# Altium project STM32F103RCT6_DEVELOPMENT_BOARD.PrjPcb
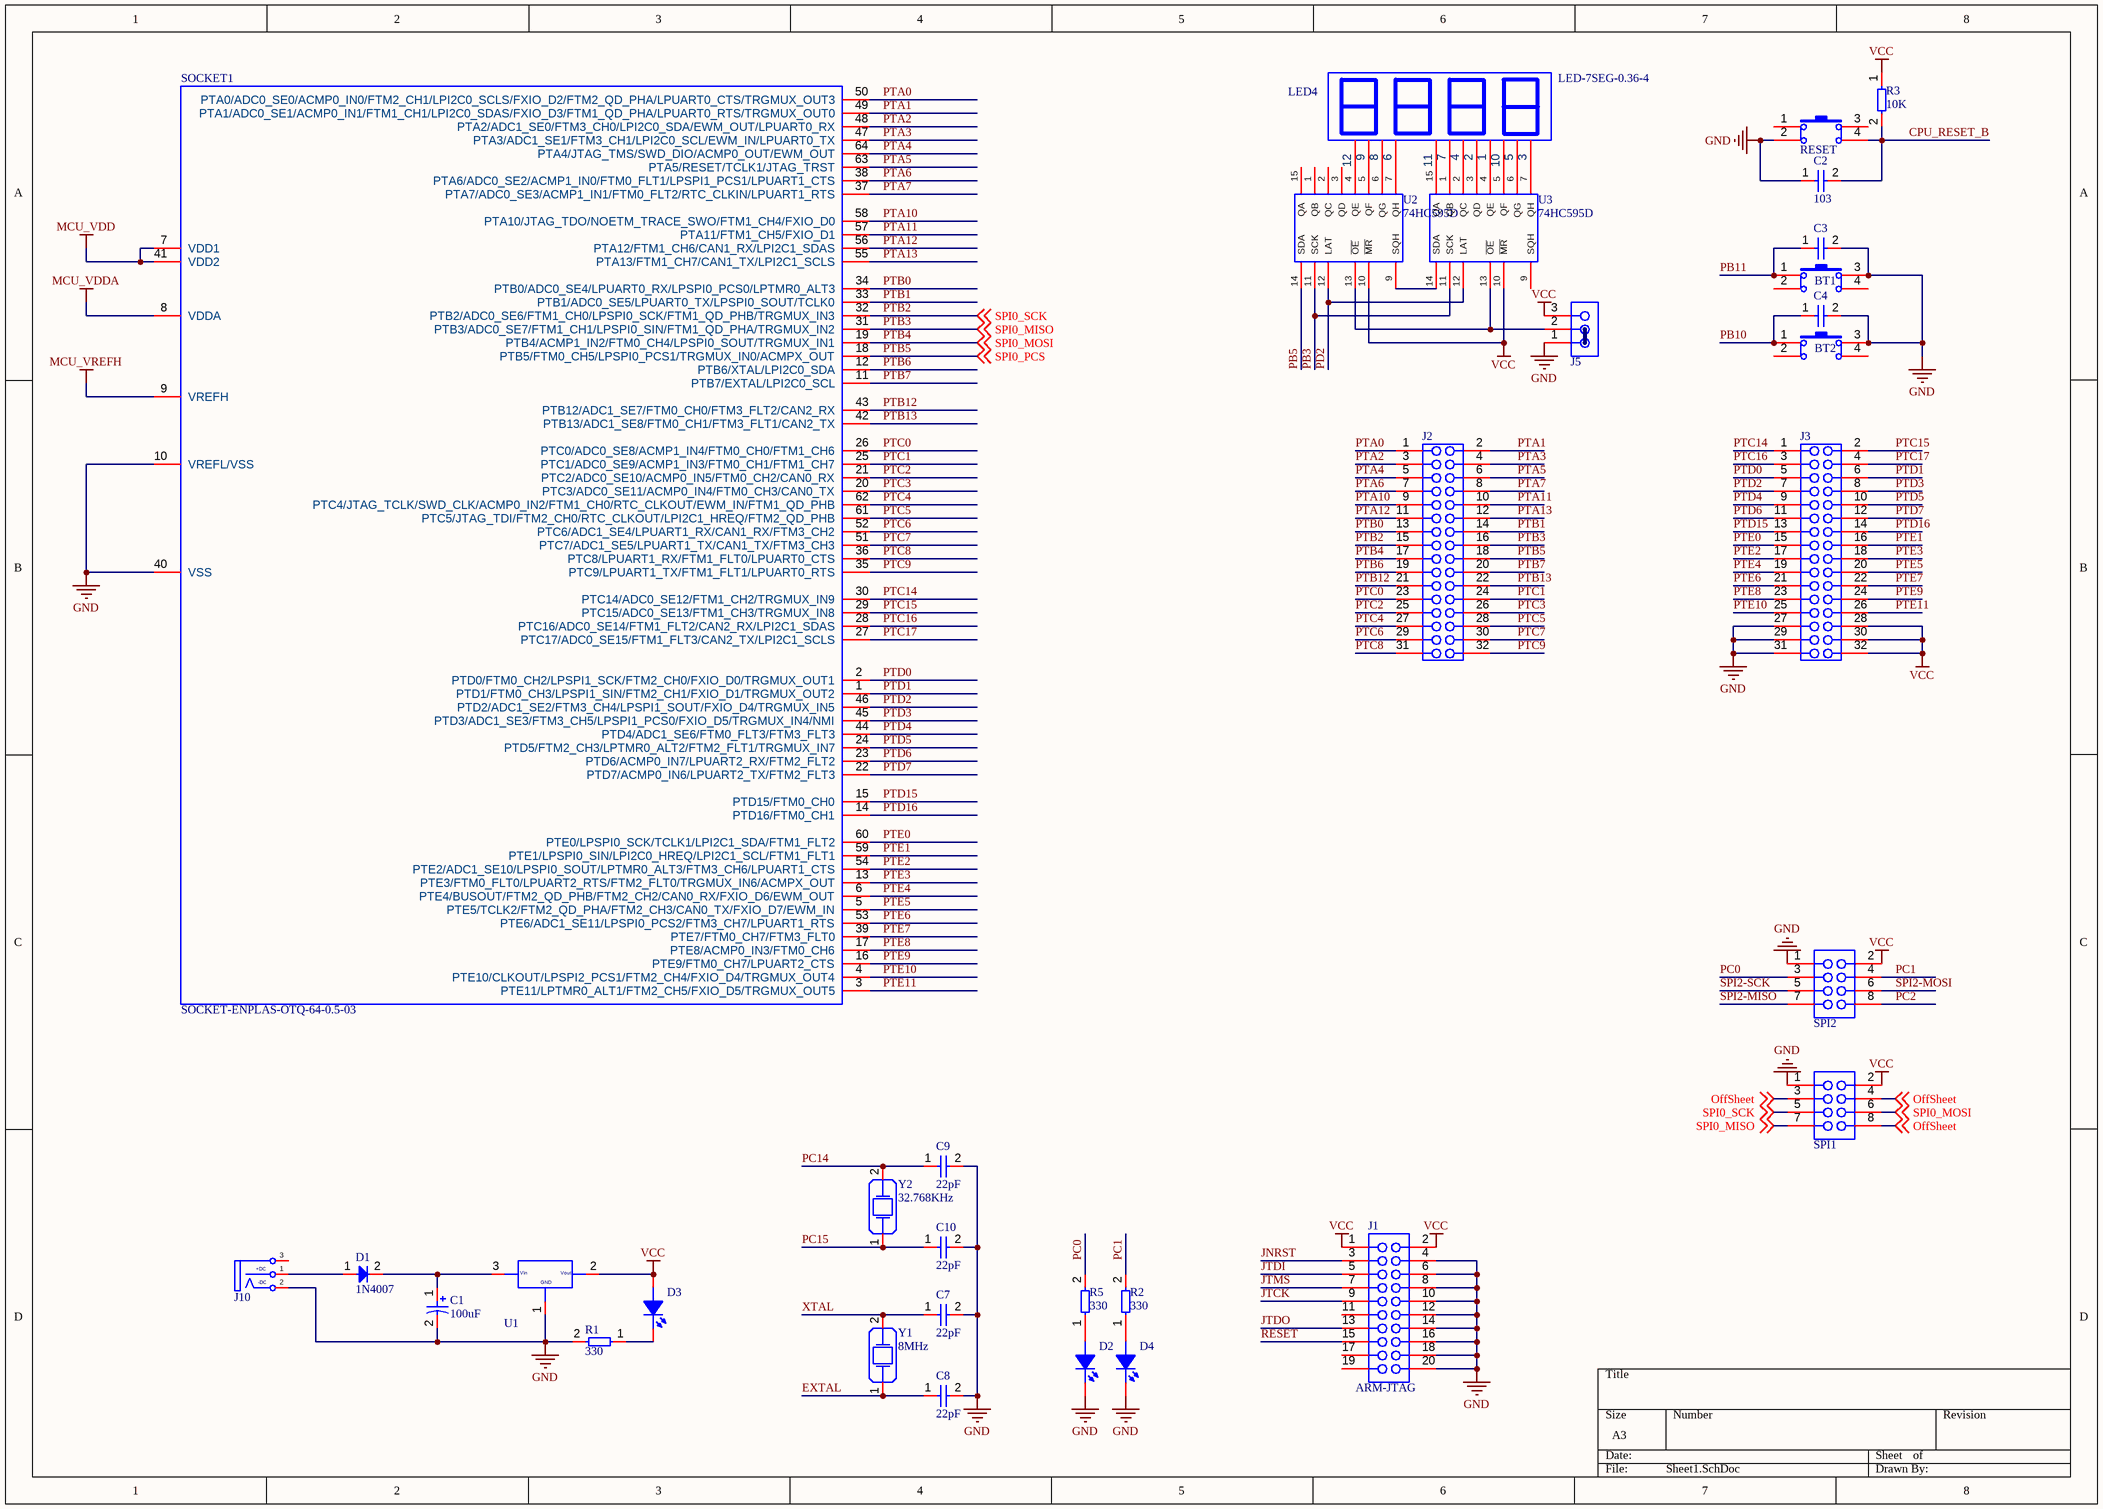
[diagram p0: Sheet1.SchDoc]
1 sheet, 33 parts. Net scope: global (net labels, ports and power ports of the same name join across sheets).
Board file: PCB1.PcbDoc

## Sheet Sheet1.SchDoc
size A3

### Parts
BT1  Button Hole  [BUTTON_HOLE_5.0mm]  (value not drawn)
BT2  Button Hole  [BUTTON_HOLE_5.0mm]  (value not drawn)
C1  100uF  [CAP_RAD_7mm]
C2  103  [C0805]
C3  103  [C0805]  (value not drawn)
C4  103  [C0805]  (value not drawn)
C7  22pF  [C0805]
C8  22pF  [C0805]
C9  22pF  [C0805]
C10  22pF  [C0805]
D1  1N4007  [DO-41]
D2  LED0805  [L0805RED]  (value not drawn)
D3  LED0805  [L0805RED]  (value not drawn)
D4  LED0805  [L0805RED]  (value not drawn)
J1  ARM-JTAG  [IDC_CONNECTOR_20_2.54]
J2  Header 16x2 TH Pitch 2.54mm  [Header 16x2 TH Pitch 2.54mm]  (value not drawn)
J3  Header 16x2 TH Pitch 2.54mm  [Header 16x2 TH Pitch 2.54mm]  (value not drawn)
J5  7SEG-OE  [Header 3x1 TH Pitch 2.54mm]  (value not drawn)
J10  Connector  [DC_K375A_Power]  (value not drawn)
LED4  LED-7SEG-0.36-4  [LED-7SEG-0.36-4]
R1  330  [RES-0.25W-H-MF]
R2  330  [R0805]
R3  10K  [RES-0.25W-H-MF]
R5  330  [R0805]
RESET  Button Hole  [BUTTON_HOLE_5.0mm]  (value not drawn)
SOCKET1  SOCKET-ENPLAS-OTQ-64-0.5-03  [SOCKET-ADAPTER-OTQ-64-05-03]
SPI1  Header 4x2 TH Pitch 2.54mm  [Header 4x2 TH Pitch 2.54mm]  (value not drawn)
SPI2  Header 4x2 TH Pitch 2.54mm  [Header 4x2 TH Pitch 2.54mm]  (value not drawn)
U1  AMS1117  [SOT223-3]  (value not drawn)
U2  74HC595D  [SO16]
U3  74HC595D  [SO16]
Y1  8MHz  [SMD5032]
Y2  32.768KHz  [DT-26]

### Nets
GND: BT1.3 BT2.3 C1.2 C2.1 C3.2 C4.2 C7.2 C8.2 C9.2 C10.2 D2.2(K) D4.2(K) J1.4 J1.6 J1.8 J1.10 J1.12 J1.14 J1.16 J1.18 J1.20 J3.27 J3.29 J3.31 J5.1 J10.2(DC-) R1.2 RESET.2 SOCKET1.10(VREFL/VSS) SOCKET1.40(VSS) SPI1.1 SPI2.1 U1.1 U2.8 U3.8
MCU_VDD: SOCKET1.7(VDD1) SOCKET1.41(VDD2)
MCU_VDDA: SOCKET1.8(VDDA)
MCU_VREFH: SOCKET1.9(VREFH)
VCC: D3.1(A) J1.1 J1.2 J3.28 J3.30 J3.32 J5.3 R3.1 SPI1.2 SPI2.2 U1.2 U2.10(~{MR}) U2.16 U3.10(~{MR}) U3.16
CPU_RESET_B: C2.2 R3.2 RESET.4
EXTAL: C8.1 Y1.1
JNRST: J1.3
JTCK: J1.9
JTDI: J1.5
JTDO: J1.13
JTMS: J1.7
OffSheet: SPI1.3 SPI1.4 SPI1.8 ; off-sheet OffSheet
PB3: U2.11(SCK) U3.11(SCK)
PB5: U2.14(SDA)
PB10: BT2.1 C4.1
PB11: BT1.1 C3.1
PC0: R5.2 SPI2.3
PC1: R2.2 SPI2.4
PC2: SPI2.8
PC14: C9.1 Y2.2
PC15: C10.1 Y2.1
PD2: U2.12(LAT) U3.12(LAT)
PTA0: J2.1 SOCKET1.50(PTA0/ADC0_SE0/ACMP0_IN0/FTM2_CH1/LPI2C0_SCLS/FXIO_D2/FTM2_QD_PHA/LPUART0_CTS/TRGMUX_OUT3)
PTA1: J2.2 SOCKET1.49(PTA1/ADC0_SE1/ACMP0_IN1/FTM1_CH1/LPI2C0_SDAS/FXIO_D3/FTM1_QD_PHA/LPUART0_RTS/TRGMUX_OUT0)
PTA2: J2.3 SOCKET1.48(PTA2/ADC1_SE0/FTM3_CH0/LPI2C0_SDA/EWM_OUT/LPUART0_RX)
PTA3: J2.4 SOCKET1.47(PTA3/ADC1_SE1/FTM3_CH1/LPI2C0_SCL/EWM_IN/LPUART0_TX)
PTA4: J2.5 SOCKET1.64(PTA4/JTAG_TMS/SWD_DIO/ACMP0_OUT/EWM_OUT)
PTA5: J2.6 SOCKET1.63(PTA5/RESET/TCLK1/JTAG_TRST)
PTA6: J2.7 SOCKET1.38(PTA6/ADC0_SE2/ACMP1_IN0/FTM0_FLT1/LPSPI1_PCS1/LPUART1_CTS)
PTA7: J2.8 SOCKET1.37(PTA7/ADC0_SE3/ACMP1_IN1/FTM0_FLT2/RTC_CLKIN/LPUART1_RTS)
PTA10: J2.9 SOCKET1.58(PTA10/JTAG_TDO/NOETM_TRACE_SWO/FTM1_CH4/FXIO_D0)
PTA11: J2.10 SOCKET1.57(PTA11/FTM1_CH5/FXIO_D1)
PTA12: J2.11 SOCKET1.56(PTA12/FTM1_CH6/CAN1_RX/LPI2C1_SDAS)
PTA13: J2.12 SOCKET1.55(PTA13/FTM1_CH7/CAN1_TX/LPI2C1_SCLS)
PTB0: J2.13 SOCKET1.34(PTB0/ADC0_SE4/LPUART0_RX/LPSPI0_PCS0/LPTMR0_ALT3)
PTB1: J2.14 SOCKET1.33(PTB1/ADC0_SE5/LPUART0_TX/LPSPI0_SOUT/TCLK0)
PTB2: J2.15 SOCKET1.32(PTB2/ADC0_SE6/FTM1_CH0/LPSPI0_SCK/FTM1_QD_PHB/TRGMUX_IN3) SPI1.5 ; off-sheet SPI0_SCK  [also labelled SPI0_SCK]
PTB3: J2.16 SOCKET1.31(PTB3/ADC0_SE7/FTM1_CH1/LPSPI0_SIN/FTM1_QD_PHA/TRGMUX_IN2) SPI1.7 ; off-sheet SPI0_MISO  [also labelled SPI0_MISO]
PTB4: J2.17 SOCKET1.19(PTB4/ACMP1_IN2/FTM0_CH4/LPSPI0_SOUT/TRGMUX_IN1) SPI1.6 ; off-sheet SPI0_MOSI  [also labelled SPI0_MOSI]
PTB5: J2.18 SOCKET1.18(PTB5/FTM0_CH5/LPSPI0_PCS1/TRGMUX_IN0/ACMPX_OUT) ; off-sheet SPI0_PCS  [also labelled SPI0_PCS]
PTB6: J2.19 SOCKET1.12(PTB6/XTAL/LPI2C0_SDA)
PTB7: J2.20 SOCKET1.11(PTB7/EXTAL/LPI2C0_SCL)
PTB12: J2.21 SOCKET1.43(PTB12/ADC1_SE7/FTM0_CH0/FTM3_FLT2/CAN2_RX)
PTB13: J2.22 SOCKET1.42(PTB13/ADC1_SE8/FTM0_CH1/FTM3_FLT1/CAN2_TX)
PTC0: J2.23 SOCKET1.26(PTC0/ADC0_SE8/ACMP1_IN4/FTM0_CH0/FTM1_CH6)
PTC1: J2.24 SOCKET1.25(PTC1/ADC0_SE9/ACMP1_IN3/FTM0_CH1/FTM1_CH7)
PTC2: J2.25 SOCKET1.21(PTC2/ADC0_SE10/ACMP0_IN5/FTM0_CH2/CAN0_RX)
PTC3: J2.26 SOCKET1.20(PTC3/ADC0_SE11/ACMP0_IN4/FTM0_CH3/CAN0_TX)
PTC4: J2.27 SOCKET1.62(PTC4/JTAG_TCLK/SWD_CLK/ACMP0_IN2/FTM1_CH0/RTC_CLKOUT/EWM_IN/FTM1_QD_PHB)
PTC5: J2.28 SOCKET1.61(PTC5/JTAG_TDI/FTM2_CH0/RTC_CLKOUT/LPI2C1_HREQ/FTM2_QD_PHB)
PTC6: J2.29 SOCKET1.52(PTC6/ADC1_SE4/LPUART1_RX/CAN1_RX/FTM3_CH2)
PTC7: J2.30 SOCKET1.51(PTC7/ADC1_SE5/LPUART1_TX/CAN1_TX/FTM3_CH3)
PTC8: J2.31 SOCKET1.36(PTC8/LPUART1_RX/FTM1_FLT0/LPUART0_CTS)
PTC9: J2.32 SOCKET1.35(PTC9/LPUART1_TX/FTM1_FLT1/LPUART0_RTS)
PTC14: J3.1 SOCKET1.30(PTC14/ADC0_SE12/FTM1_CH2/TRGMUX_IN9)
PTC15: J3.2 SOCKET1.29(PTC15/ADC0_SE13/FTM1_CH3/TRGMUX_IN8)
PTC16: J3.3 SOCKET1.28(PTC16/ADC0_SE14/FTM1_FLT2/CAN2_RX/LPI2C1_SDAS)
PTC17: J3.4 SOCKET1.27(PTC17/ADC0_SE15/FTM1_FLT3/CAN2_TX/LPI2C1_SCLS)
PTD0: J3.5 SOCKET1.2(PTD0/FTM0_CH2/LPSPI1_SCK/FTM2_CH0/FXIO_D0/TRGMUX_OUT1)
PTD1: J3.6 SOCKET1.1(PTD1/FTM0_CH3/LPSPI1_SIN/FTM2_CH1/FXIO_D1/TRGMUX_OUT2)
PTD2: J3.7 SOCKET1.46(PTD2/ADC1_SE2/FTM3_CH4/LPSPI1_SOUT/FXIO_D4/TRGMUX_IN5)
PTD3: J3.8 SOCKET1.45(PTD3/ADC1_SE3/FTM3_CH5/LPSPI1_PCS0/FXIO_D5/TRGMUX_IN4/NMI)
PTD4: J3.9 SOCKET1.44(PTD4/ADC1_SE6/FTM0_FLT3/FTM3_FLT3)
PTD5: J3.10 SOCKET1.24(PTD5/FTM2_CH3/LPTMR0_ALT2/FTM2_FLT1/TRGMUX_IN7)
PTD6: J3.11 SOCKET1.23(PTD6/ACMP0_IN7/LPUART2_RX/FTM2_FLT2)
PTD7: J3.12 SOCKET1.22(PTD7/ACMP0_IN6/LPUART2_TX/FTM2_FLT3)
PTD15: J3.13 SOCKET1.15(PTD15/FTM0_CH0)
PTD16: J3.14 SOCKET1.14(PTD16/FTM0_CH1)
PTE0: J3.15 SOCKET1.60(PTE0/LPSPI0_SCK/TCLK1/LPI2C1_SDA/FTM1_FLT2)
PTE1: J3.16 SOCKET1.59(PTE1/LPSPI0_SIN/LPI2C0_HREQ/LPI2C1_SCL/FTM1_FLT1)
PTE2: J3.17 SOCKET1.54(PTE2/ADC1_SE10/LPSPI0_SOUT/LPTMR0_ALT3/FTM3_CH6/LPUART1_CTS)
PTE3: J3.18 SOCKET1.13(PTE3/FTM0_FLT0/LPUART2_RTS/FTM2_FLT0/TRGMUX_IN6/ACMPX_OUT)
PTE4: J3.19 SOCKET1.6(PTE4/BUSOUT/FTM2_QD_PHB/FTM2_CH2/CAN0_RX/FXIO_D6/EWM_OUT)
PTE5: J3.20 SOCKET1.5(PTE5/TCLK2/FTM2_QD_PHA/FTM2_CH3/CAN0_TX/FXIO_D7/EWM_IN)
PTE6: J3.21 SOCKET1.53(PTE6/ADC1_SE11/LPSPI0_PCS2/FTM3_CH7/LPUART1_RTS)
PTE7: J3.22 SOCKET1.39(PTE7/FTM0_CH7/FTM3_FLT0)
PTE8: J3.23 SOCKET1.17(PTE8/ACMP0_IN3/FTM0_CH6)
PTE9: J3.24 SOCKET1.16(PTE9/FTM0_CH7/LPUART2_CTS)
PTE10: J3.25 SOCKET1.4(PTE10/CLKOUT/LPSPI2_PCS1/FTM2_CH4/FXIO_D4/TRGMUX_OUT4)
PTE11: J3.26 SOCKET1.3(PTE11/LPTMR0_ALT1/FTM2_CH5/FXIO_D5/TRGMUX_OUT5)
RESET: J1.15
SPI2-MISO: SPI2.7
SPI2-MOSI: SPI2.6
SPI2-SCK: SPI2.5
XTAL: C7.1 Y1.2
NetC1_1: C1.1 D1.2 U1.3
NetD1_1: D1.1 J10.1(DS+)
NetD2_1: D2.1(A) R5.1
NetD3_2: D3.2(K) R1.1
NetD4_1: D4.1(A) R2.1
NetJ5_2: J5.2 U2.13(~{OE}) U3.13(~{OE})
NetLED4_1: LED4.1 U3.4(QE)
NetLED4_2: LED4.2 U3.3(QD)
NetLED4_3: LED4.3 U3.7(QH)
NetLED4_4: LED4.4 U3.2(QC)
NetLED4_5: LED4.5 U3.6(QG)
NetLED4_6: LED4.6 U2.7(QH)
NetLED4_7: LED4.7 U3.1(QB)
NetLED4_8: LED4.8 U2.6(QG)
NetLED4_9: LED4.9 U2.5(QF)
NetLED4_10: LED4.10 U3.5(QF)
NetLED4_11: LED4.11 U3.15(QA)
NetLED4_12: LED4.12 U2.4(QE)
NetU2_9: U2.9(SQH) U3.14(SDA)

Not connected (* = marked no-connect by the designer): BT1 2 4; BT2 2 4; J1 11 17 19; J10 3(T); RESET 1 3; U2 1(QB) 2(QC) 3(QD) 15(QA); U3 9(SQH)

### Notes on the sheet
- (in symbol AMS1117(SOT-223)) Vin; Vout; GND
- (in symbol JackDC) +DC; -DC

### Library data of the parts
C1 = Capacitor(Radian)
C2-C4 C7-C10 = C0805
J1 = IDC_2.54_10x2
J5 = Header 3x1 TH Pitch 2.54mm
J10 = JackDC
R1 R3 = Resistors THD
R2 R5 = Resistor SMD
SOCKET1 = S32K118-SOCKET-ENPLAS-OTQ-64-0.5-03
U1 = AMS1117(SOT-223)
Y1 = Crystal
Y2 = Crystal 32.768KHz